# Altium schematic sheet Connectors.SchDoc
size A4; SheetNumber: 4; SheetTotal: 5
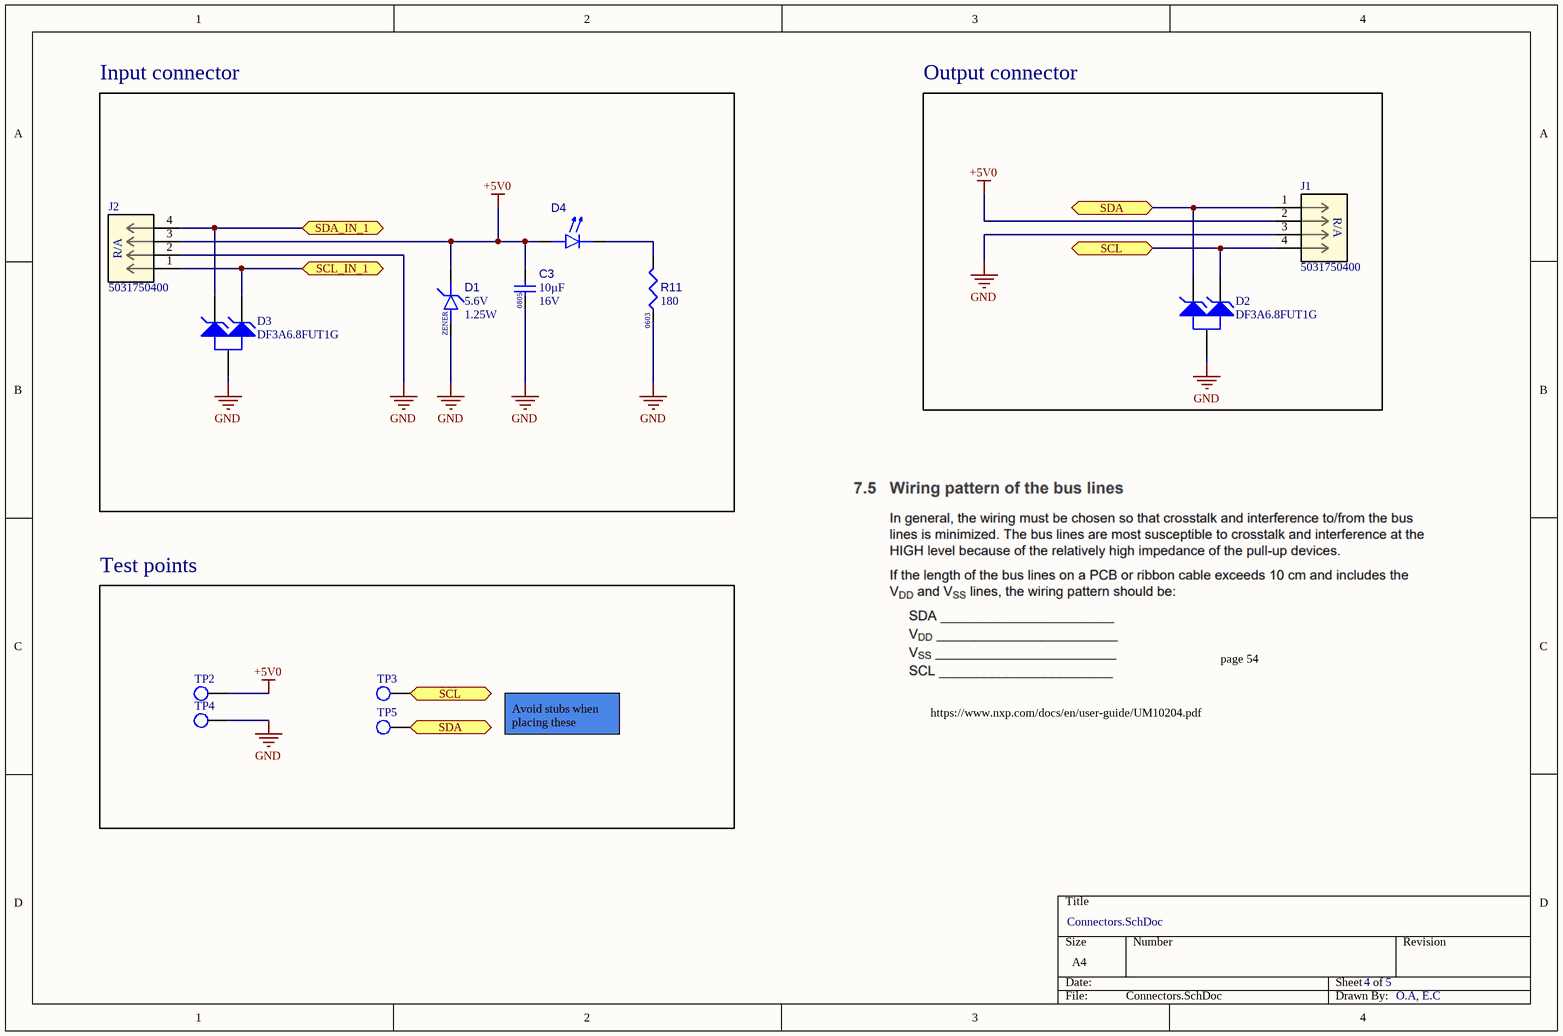
[diagram p0: Connectors.SchDoc]

## Parts
C3  value 10µF  Voltage Rating: 16V  Case/Package: 0805  [CAP CER 10UF 16V X5R 0805-Footprint-1]  (hidden comment: CAP CER 10UF 16V X5R 0805)
D1  Diode Type: ZENER  Reference Voltage-Nom: 5.6V  Max Power Dissipation: 1.25W  [FP-S8-V-3848_01-003-MFG]  (hidden comment: BZG05C5V6-M3-08)
D2  DF3A6.8FUT1G  [ONSC-SC-70-3-419-04_V]
D3  DF3A6.8FUT1G  [ONSC-SC-70-3-419-04_V]
D4  150060RS75000  [WL-SMCW_0603_150060xx75000]  (value not drawn)
J1  5031750400  [5031750400-Footprint-1]
J2  5031750400  [5031750400-Footprint-1]
R11  value 180  Case/Package: 0603  [RESC0603(1608)_N]  (hidden comment: RC0603JR-07180RL)
TP2  RCUCTE  [FP-S2761-46R-MFG]  (value not drawn)
TP3  RCUCTE  [FP-S2761-46R-MFG]  (value not drawn)
TP4  RCUCTE  [FP-S2761-46R-MFG]  (value not drawn)
TP5  RCUCTE  [FP-S2761-46R-MFG]  (value not drawn)

## Blocks framed on the sheet
Input connector: C3 D1 D3 D4 J2 R11
Output connector: D2 J1
Test points: TP2-TP5

## Ports
SCL (bidir), SCL_IN_1 (bidir), SDA (bidir), SDA_IN_1 (bidir)

## Nets
+5V0: C3.2 D1.1(K) D4.2(A) J1.2 J2.3 TP2.1
GND: C3.1 D1.2(A) D2.3(A) D3.3(A) J1.3 J2.2 R11.1 TP4.1
SCL: D2.2(K2) J1.4 TP3.1 ; port SCL
SCL_IN_1: D3.2(K2) J2.1 ; port SCL_IN_1
SDA: D2.1(K1) J1.1 TP5.1 ; port SDA
SDA_IN_1: D3.1(K1) J2.4 ; port SDA_IN_1
NetD4_1: D4.1(K) R11.2

## Notes on the sheet
- https://www.nxp.com/docs/en/user-guide/UM10204.pdf
- page 54
- Avoid stubs when placing these
- O.A, E.C
- (in symbol CMP-002-00074-2) R/A

## Library data of the parts
C3 = CMP-001-00084-6: Ceramic Capacitor, Multilayer, Ceramic, 16V, 10% +Tol, 10% -Tol, X5R, 15% TC, 10uF, Surface Mount, 0805; Pins: 2; Capacitor Type: Ceramic; Max Operating Temperature: 85°C; Min Operating Temperature: -55°C; RoHS Compliant: Yes; Mounting Technology: Surface Mount
D1 = CMP-004-00042-1: Zener Diode, 5.6V V(Z), 7.14%, 1.25W, Silicon, Unidirectional, DO-214AC; Package Body Material: Plastic; Number of Elements: 1; Time @ Peak Reflow Temperature-Max (s): 30s; Test Current: 45mA; Additional Feature: HIGH RELIABILITY; RoHS Compliant: Yes; JEDEC-95 Code: DO-214AC; Pins: 2; JESD-30 Code: R-PDSO-C2; Terminal Position: DUAL; Package Style: SMALL OUTLINEMeter; Package Shape: Rectangular; JESD-609 Code: e3; Technology: ZENER; Moisture Sensitivity Level: 1; Surface Mount: Yes; Reach SVHC Compliant: No; Terminal Form: C BEND; Polarity: Unidirectional; Max Operating Temperature: 150°C; Peak Reflow Temperature (Cel): 260°C; Terminal Finish: Tin; Voltage Tol-Max: 7.14%; Diode Element Material: SILICON
D2 D3 = CMP-004-00039-1: Trans Voltage Suppressor Diode, 150W, Unidirectional, 2 Element, Silicon; Dynamic Impedance-Max: 50R; Time @ Peak Reflow Temperature-Max (s): 40s; Test Current: 5mA; Max Power Dissipation: 200mW; Package Body Material: Plastic; Number of Elements: 2; Voltage Tol-Max: 5.9%; Max Breakdown Voltage: 7.2V; Qualification Status: Not Qualified; Min Breakdown Voltage: 6.4V; Reference Voltage-Nom: 6.8V; Terminal Form: Gull Wing; Reach SVHC Compliant: Yes; Package Shape: Rectangular; Terminal Finish: Tin; Terminal Position: DUAL; JESD-609 Code: e3; Non-rep Peak Rev Power Dis-Max: 150W; Surface Mount: Yes; Diode Type: TRANS VOLTAGE SUPPRESSOR; Technology: ZENER; Polarity: Unidirectional; Max Operating Temperature: 150°C; Moisture Sensitivity Level: 1; Diode Element Material: SILICON; Min Operating Temperature: -55°C; Package Style: SMALL OUTLINEMeter; Pins: 3; Peak Reflow Temperature (Cel): 260°C; JESD-30 Code: R-PDSO-G3; RoHS Compliant: Yes
D4 = CMP-007-00036-1: Single Color LED, Red, Water Clear, 1.1mm; Forward Current: 30mA; Max Operating Temperature: 85°C; Mounting Technology: Surface Mount; RoHS Compliant: Yes; Pins: 2; Min Operating Temperature: -40°C
J1 J2 = CMP-002-00074-2: DIP Connector, 4 Contact(s), 2 Row(s), Female, Right Angle, 0.059 inch Pitch, Solder Terminal, Locking, Beige Insulator, Receptacle; Connector Type: DIP; Min Operating Temperature: -85°C; Mounting Technology: Board; RoHS Compliant: Yes; Max Operating Temperature: 85°C
R11 = CMP-009-00178-1: Fixed Resistor, Metal Glaze/thick Film, 0.1W, 180ohm, 75V, 5% +/-Tol, 100ppm/Cel, Surface Mount, 0603; Power: 100mW; Tolerance: 5%; Pins: 2; Mounting Technology: Surface Mount; RoHS Compliant: Yes; Max Operating Temperature: 155°C; Min Operating Temperature: -55°C
TP2-TP5 = CMP-002-00072-5: Test point; Connector Type: Interconnection Device; Pins: 2; Max Operating Temperature: 125°C; Case/Package: 0603; Mounting Technology: Surface Mount; RoHS Compliant: Yes; Min Operating Temperature: -55°C